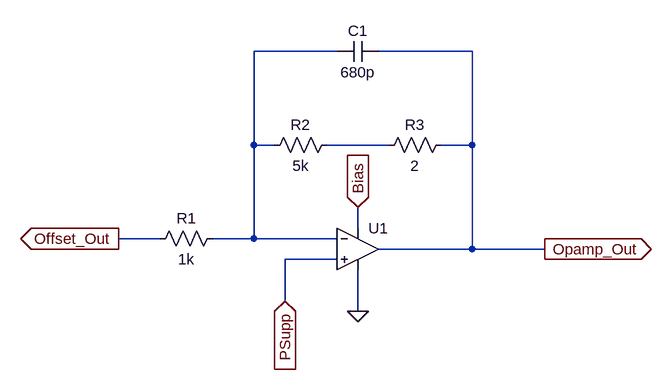
[diagram p0: schematic OpAmp_Draft.asc]
OpAmp_Draft.asc, the LTspice schematic file:
Version 4.1
SHEET 1 880 680
WIRE 176 -80 48 -80
WIRE 384 -80 240 -80
WIRE 48 64 48 -80
WIRE 80 64 48 64
WIRE 256 64 160 64
WIRE 384 64 384 -80
WIRE 384 64 336 64
WIRE 208 192 208 160
WIRE -96 208 -160 208
WIRE 48 208 48 64
WIRE 48 208 -16 208
WIRE 176 208 48 208
WIRE 384 224 384 64
WIRE 384 224 240 224
WIRE 496 224 384 224
WIRE 176 240 96 240
WIRE 96 304 96 240
WIRE 208 320 208 256
FLAG 208 320 0
FLAG -160 208 Offset_Out
IOPIN -160 208 Out
FLAG 96 304 PSupp
IOPIN 96 304 In
FLAG 208 160 Bias
IOPIN 208 160 In
FLAG 496 224 Opamp_Out
IOPIN 496 224 Out
SYMBOL res 0 192 R90
WINDOW 0 0 56 VBottom 2
WINDOW 3 32 56 VTop 2
SYMATTR InstName R1
SYMATTR Value 1k
SYMBOL res 176 48 R90
WINDOW 0 0 56 VBottom 2
WINDOW 3 32 56 VTop 2
SYMATTR InstName R2
SYMATTR Value 5k
SYMBOL res 352 48 R90
WINDOW 0 0 56 VBottom 2
WINDOW 3 32 56 VTop 2
SYMATTR InstName R3
SYMATTR Value 2
SYMBOL cap 240 -96 R90
WINDOW 0 0 32 VBottom 2
WINDOW 3 32 32 VTop 2
SYMATTR InstName C1
SYMATTR Value 680p
SYMBOL OpAmps\\UniversalOpAmp 208 224 R0
SYMATTR InstName U1

The netlist it stands for:
* OpAmp_Draft.asc
R1 N001 Offset_Out 1k
R2 N002 N001 5k
R3 Opamp_Out N002 2
C1 Opamp_Out N001 680p
X§U1 PSupp N001 Bias 0 Opamp_Out level1 Avol=1Meg GBW=10Meg Vos=0 En=0 Enk=0 In=0 Ink=0 Rin=500Meg  ; pins In+ In- V+ V- OUT
.lib UniversalOpAmp1.lib
.backanno
.end